# Altium project JacdacBrainESP32 48.PrjPCB (part 2 of 2)
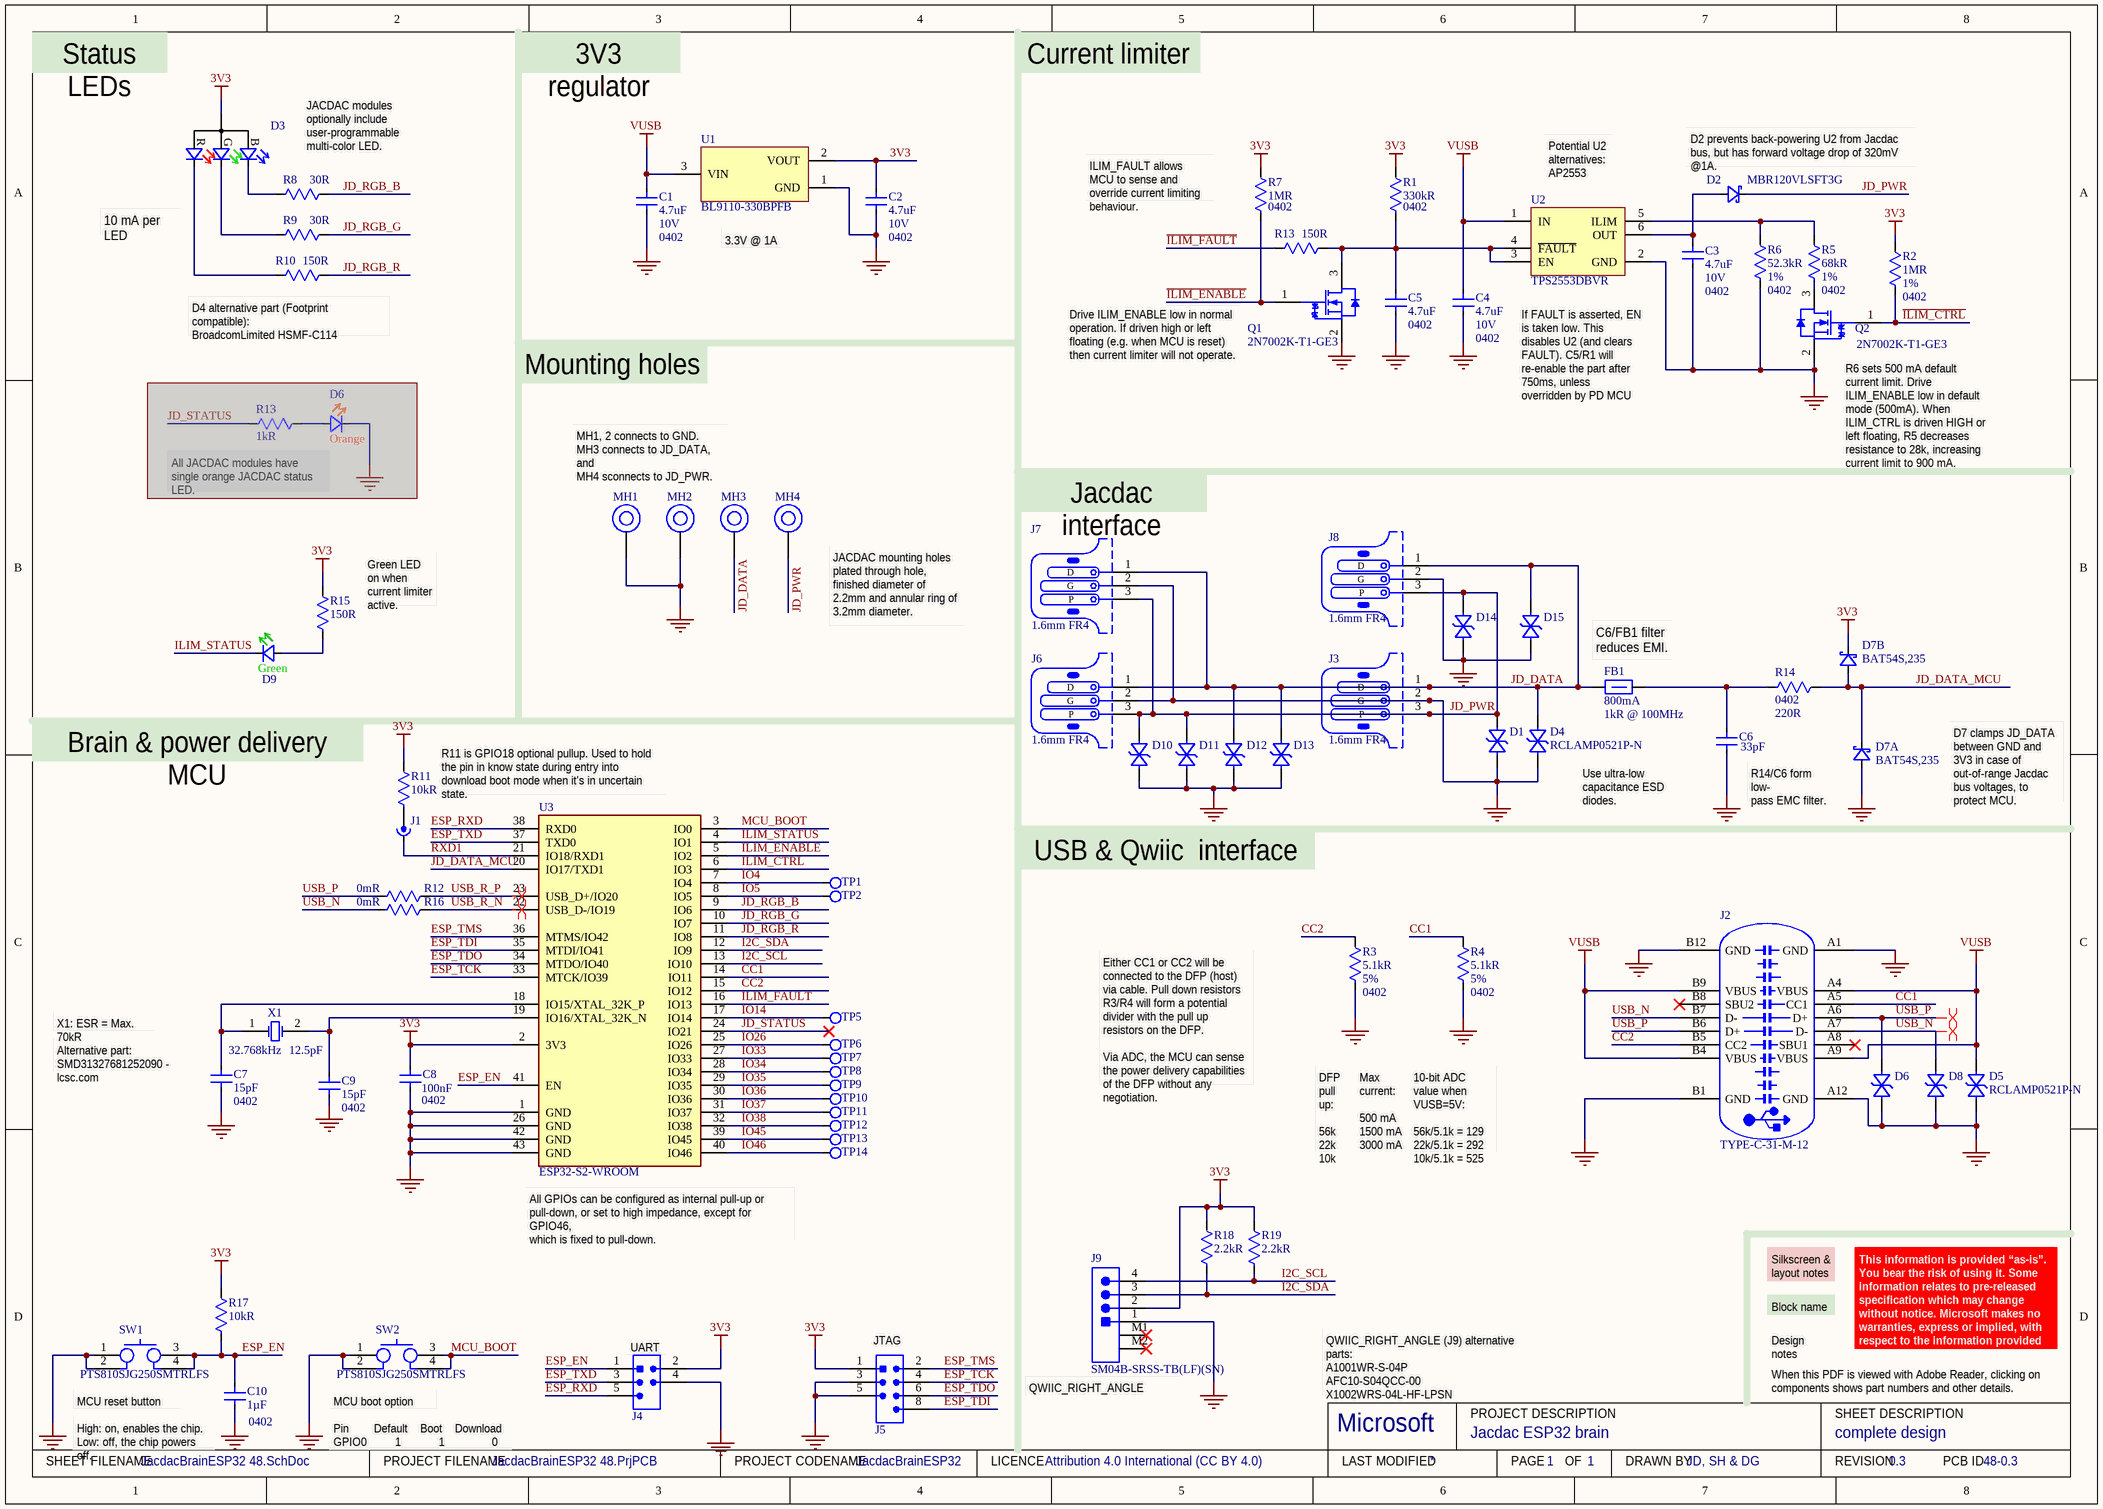
[diagram p1: JacdacBrainESP32 48.SchDoc]

## Assembly variants
JLCPCB: alternate parts J9 -> A1001WR-S-04P, R17 -> 0402WGF1002TCE, R11 -> 0402WGF1002TCE, X1 -> X321532768KGD2SI, R3 -> 0402WGF5101TCE, R4 -> 0402WGF5101TCE, R10 -> 0402WGF1500TCE, R13 -> 0402WGF1500TCE, R2 -> 0402WGF1004TCE, R7 -> 0402WGF1004TCE, R1 -> 0402WGF3303TCE, R6 -> 0402WGF5232TCE, R5 -> RT0402FRE0768KL, D2 -> RB161MM-20TR